# Altium schematic sheet IAM_20380_BREAKOUT_BOARD.SchDoc: IAM-20380 Breakout Board
size A; Author: Jason Popich; DocumentNumber: N/A; Revision: 001; SheetNumber: 1; SheetTotal: 1
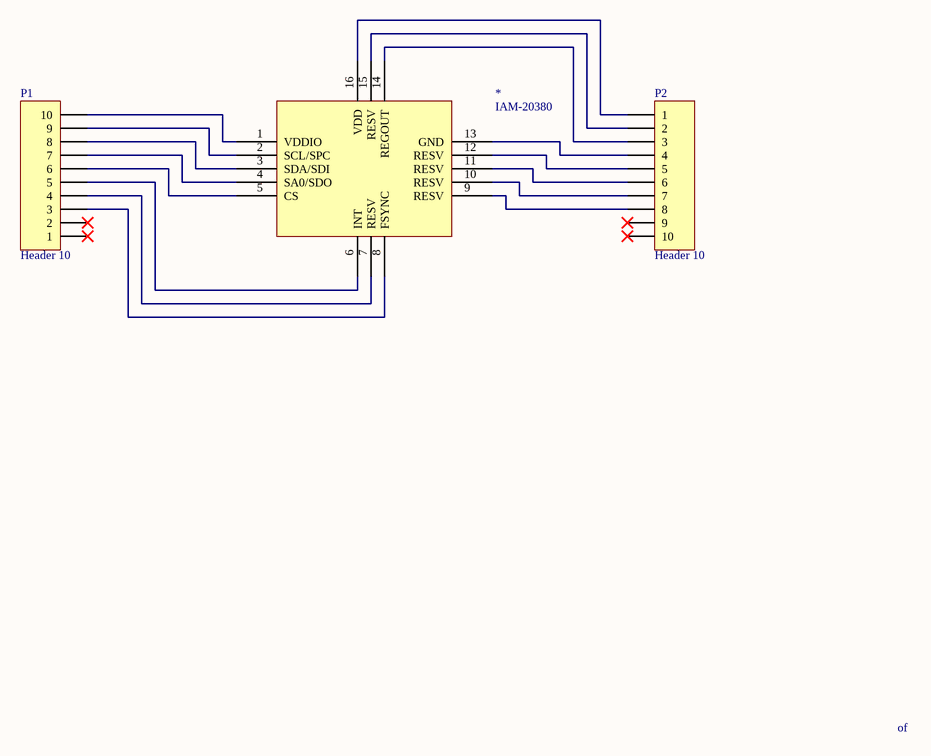
[diagram p0: IAM_20380_BREAKOUT_BOARD.SchDoc]

## Parts
*  IAM-20380  [Gyro - IAM20380]
P1  Header 10  [HDR1X10]
P2  Header 10  [HDR1X10]

## Nets
Net*_1: *.1(VDDIO) P1.10
Net*_2: *.2(SCL/SPC) P1.9
Net*_3: *.3(SDA/SDI) P1.8
Net*_4: *.4(SA0/SDO) P1.7
Net*_5: *.5(CS) P1.6
Net*_6: *.6(INT) P1.5
Net*_7: *.7(RESV) P1.4
Net*_8: *.8(FSYNC) P1.3
Net*_9: *.9(RESV) P2.8
Net*_10: *.10(RESV) P2.7
Net*_11: *.11(RESV) P2.6
Net*_12: *.12(RESV) P2.5
Net*_13: *.13(GND) P2.4
Net*_14: *.14(REGOUT) P2.3
Net*_15: *.15(RESV) P2.2
Net*_16: *.16(VDD) P2.1

Not connected (* = marked no-connect by the designer): P1 1* 2*; P2 9* 10*

## Notes on the sheet
- of

## Library data of the parts
* = IAM-20380: IAM-20380 High Performance Gyroscope
P1 P2 = Header 10: Header, 10-Pin; LatestRevisionDate: 17-Jul-2002; LatestRevisionNote: Re-released for DXP Platform.; Publisher: Altium Limited